# Altium schematic sheet Main.SchDoc: Breakout 18pin
size A3; Organization: INTERCREATE; Address1: 2415 3RD ST. SUITE #232; Address2: SAN FRANCISCO CA 94107; SheetNumber: 1; SheetTotal: 1; ProjectName: KAGWERKS COMMAND CENTER
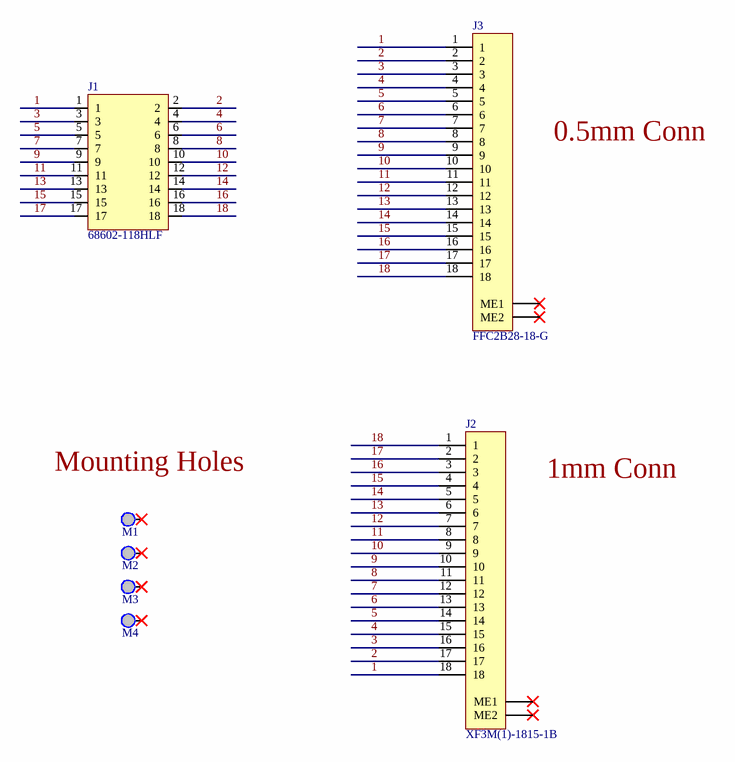
[diagram p0: Main.SchDoc]

## Parts
J1  68602-118HLF  [HDR-V-2X9-2.54MM]
J2  XF3M(1)-1815-1B  [CONN-FFC-H-18P-1MM]
J3  FFC2B28-18-G  [CONN-FFC-H-18P-0.5MM]
M1  MTG_HOLE  [MH_P_2.5MM]  (value not drawn)  (no BOM)
M2  MTG_HOLE  [MH_P_2.5MM]  (value not drawn)  (no BOM)
M3  MTG_HOLE  [MH_P_2.5MM]  (value not drawn)  (no BOM)
M4  MTG_HOLE  [MH_P_2.5MM]  (value not drawn)  (no BOM)

## Nets
1: J1.1 J2.18 J3.1
2: J1.2 J2.17 J3.2
3: J1.3 J2.16 J3.3
4: J1.4 J2.15 J3.4
5: J1.5 J2.14 J3.5
6: J1.6 J2.13 J3.6
7: J1.7 J2.12 J3.7
8: J1.8 J2.11 J3.8
9: J1.9 J2.10 J3.9
10: J1.10 J2.9 J3.10
11: J1.11 J2.8 J3.11
12: J1.12 J2.7 J3.12
13: J1.13 J2.6 J3.13
14: J1.14 J2.5 J3.14
15: J1.15 J2.4 J3.15
16: J1.16 J2.3 J3.16
17: J1.17 J2.2 J3.17
18: J1.18 J2.1 J3.18

Not connected (* = marked no-connect by the designer): J2 ME1* ME2*; J3 ME1* ME2*; M1 1*; M2 1*; M3 1*; M4 1*

## Notes on the sheet
- (near J3) 0.5mm Conn
- (near M1) Mounting Holes
- (near J2) 1mm Conn
- Title
- Size:
- Date:
- A3
- Number:
- Time:
- Revision:
- Sheet
- of
- File:

## Library data of the parts
J1 = HDR-V-2X9-M-2.54MM: Conn Unshrouded Header HDR 18 POS 2.54mm Solder ST Top Entry Thru-Hole BergStik® Bulk; Manufacturer 1: Amphenol ICC / FCI; Current Rating: 3A; Voltage Rating: 1.5kV; Number of Positions: 18; Insulation Resistance: 5GR; Gender: Male; Row Spacing: 0.1inch; Contact Post Length: 3.81mm; Supplier: Arrow Electronics; Supplier Part Number: 68602-118HLF; Manufacturer Part Number 1: 68602-118HLF; RoHS: Yes; Category: Connectors; Stock: 380; Pricing: 1=0.1296 (USD); Mounting Technology: Through Hole; Color: Black; Contact Plating: Gold,GXT; Contact Material: Bronze; Housing Color: Black; Housing Material: Thermoplastic; Min Operating Temperature: -65°C; Max Operating Temperature: 125°C; Number of Rows: 2; Contact Gender: Male; Packaging: Bulk; Package Quantity: 400; Termination: Solder; Max Voltage Rating (AC): 1.5kV; Number of Contacts: 18; Orientation: Straight; Series: BERGSTIK® II, MezzSelect™, Basics+; Contact Type: Male Pin; Length: 22.86mm; Pitch: 2.54mm; Contact Mating Length: 0.23inch; Depth: 4.83mm; Radiation Hardening: No; Flammability Rating: UL94 V-0; ComponentLink1URL: https://datasheet.ciiva.com/5168/67996-5168806.pdf?src-supplier=Mouser; ComponentLink1Description: https://datasheet.ciiva.com/5168/67996-5168806.pdf?src-supplier=Mouser; ComponentLink2URL: https://datasheet.ciiva.com/10135/67996-10135126.pdf?src-supplier=Avnet; ComponentLink2Description: https://datasheet.ciiva.com/10135/67996-10135126.pdf?src-supplier=Avnet
J2 = CONN-FFC-H-18P-1MM: FFC & FPC Connectors RotaryBackLock 1.0mm Dual Contact 18pin; Manufacturer 1: Omron; Actuator Material: Polymer,Liquid Crystal Polymer; Actuator Color: Black; Voltage Rating: 50V; Current Rating: 500mA; Number of Positions: 18; Max Voltage Rating (DC): 5.05kV; Contact Resistance: 50mR; Insulation Resistance: 100MR; Mating Cycles: 20; Pitch: 1mm; Supplier: Newark; Supplier Part Number: 40AJ2874; Manufacturer Part Number 1: XF3M(1)-1815-1B; RoHS: Yes; Category: FFC / FPC; Stock: 740; Pricing: 1500=1.15 (USD); Mounting Technology: Surface Mount; Contact Material: Copper Alloy; Contact Plating: Gold; Housing Material: Polymer; Housing Color: Natural; Min Operating Temperature: -30°C; Max Operating Temperature: 85°C; Packaging: Tape and Reel; Number of Rows: 1; Termination: Solder; Number of Contacts: 18; Orientation: Right Angle; Series: XF3M; Package Quantity: 1500; Max Current Rating: 500mA; Contact Location: Dual; Flammability Rating: UL94 V-0; RoHS Compliant: Yes; ComponentLink1URL: https://datasheet.ciiva.com/29758/xf3m-0813-29758486.pdf?src-supplier=Digi-Key; ComponentLink1Description: https://datasheet.ciiva.com/29758/xf3m-0813-29758486.pdf?src-supplier=Digi-Key; ComponentLink2URL: https://datasheet.ciiva.com/29758/xf3m-0813-29758490.pdf?src-supplier=Digi-Key; ComponentLink2Description: https://datasheet.ciiva.com/29758/xf3m-0813-29758490.pdf?src-supplier=Digi-Key
J3 = CONN-FFC-H-18P-0.5MM: 18W, 0.5MM Ffc Con, R/a, Dual Cont,; Manufacturer 1: Global Connector Technology; Supplier: Newark; Supplier Part Number: 49AJ2853; Manufacturer Part Number 1: FFC2B28-18-G; RoHS: No; Category: Connectors; Stock: 3153; Pricing: 1=0.207, 10=0.207, 25=0.207, 50=0.207, 100=0.207, 250=0.207, 500=0.207 (USD)
M1-M4 = MTG_HOLE: MTG HOLE PLATED VARIOUS SIZES